# EAGLE design GRSS (EAGLE 7.7.0)

## Sheet 1 of 4: Title_TOC
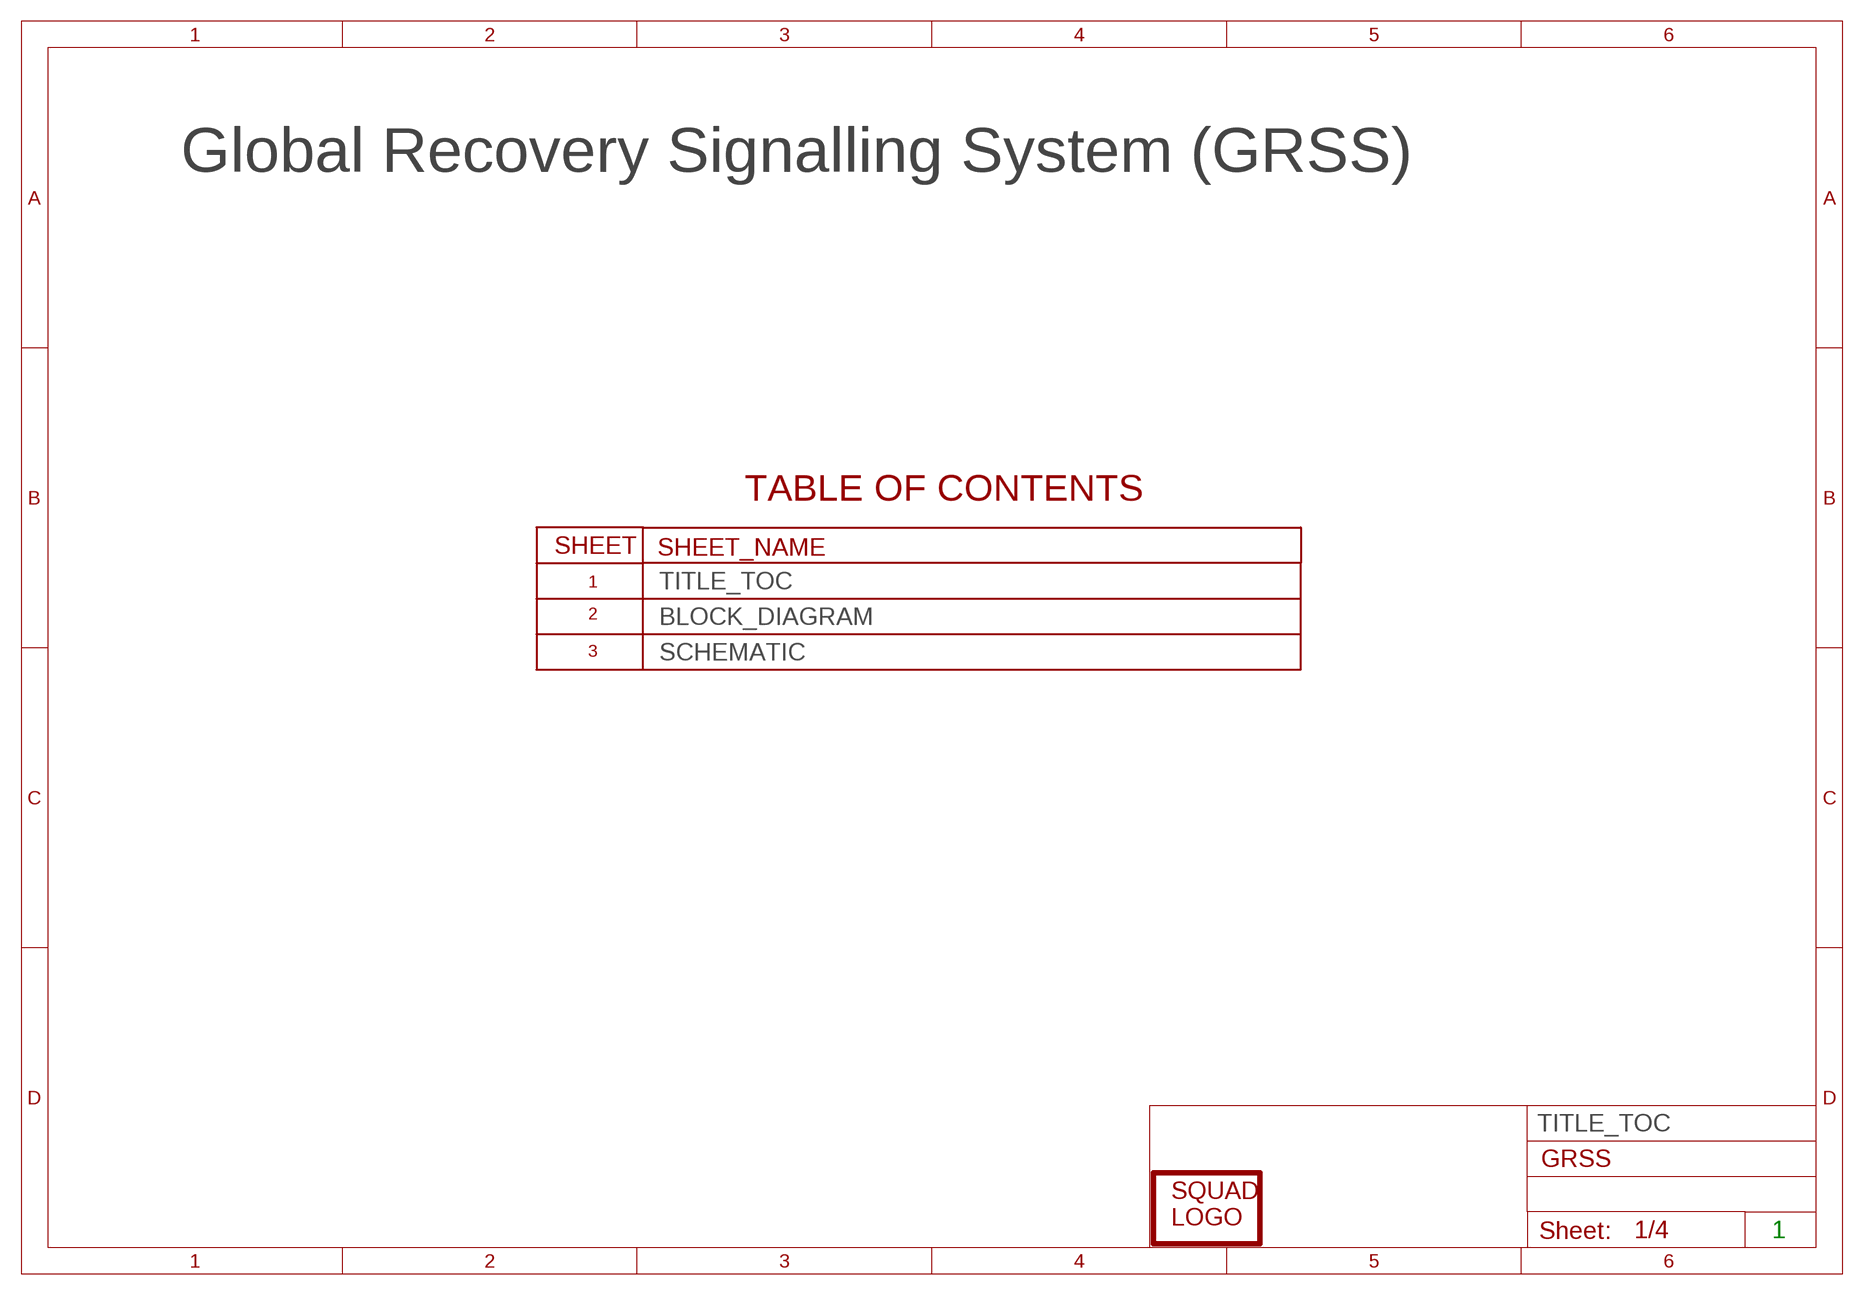
[diagram p0: schematic, sheet 1]
U$1 (TOC): VALUE: TOC

### Parts
LOGO1  LOGO  SQUAD_LOGO  [SQUAD_LOGO]

### Notes on the sheet
- Global Recovery Signalling System (GRSS)
- TITLE_TOC
- BLOCK_DIAGRAM
- SCHEMATIC
- TITLE_TOC
- 1

## Sheet 2 of 4: Block Diagram
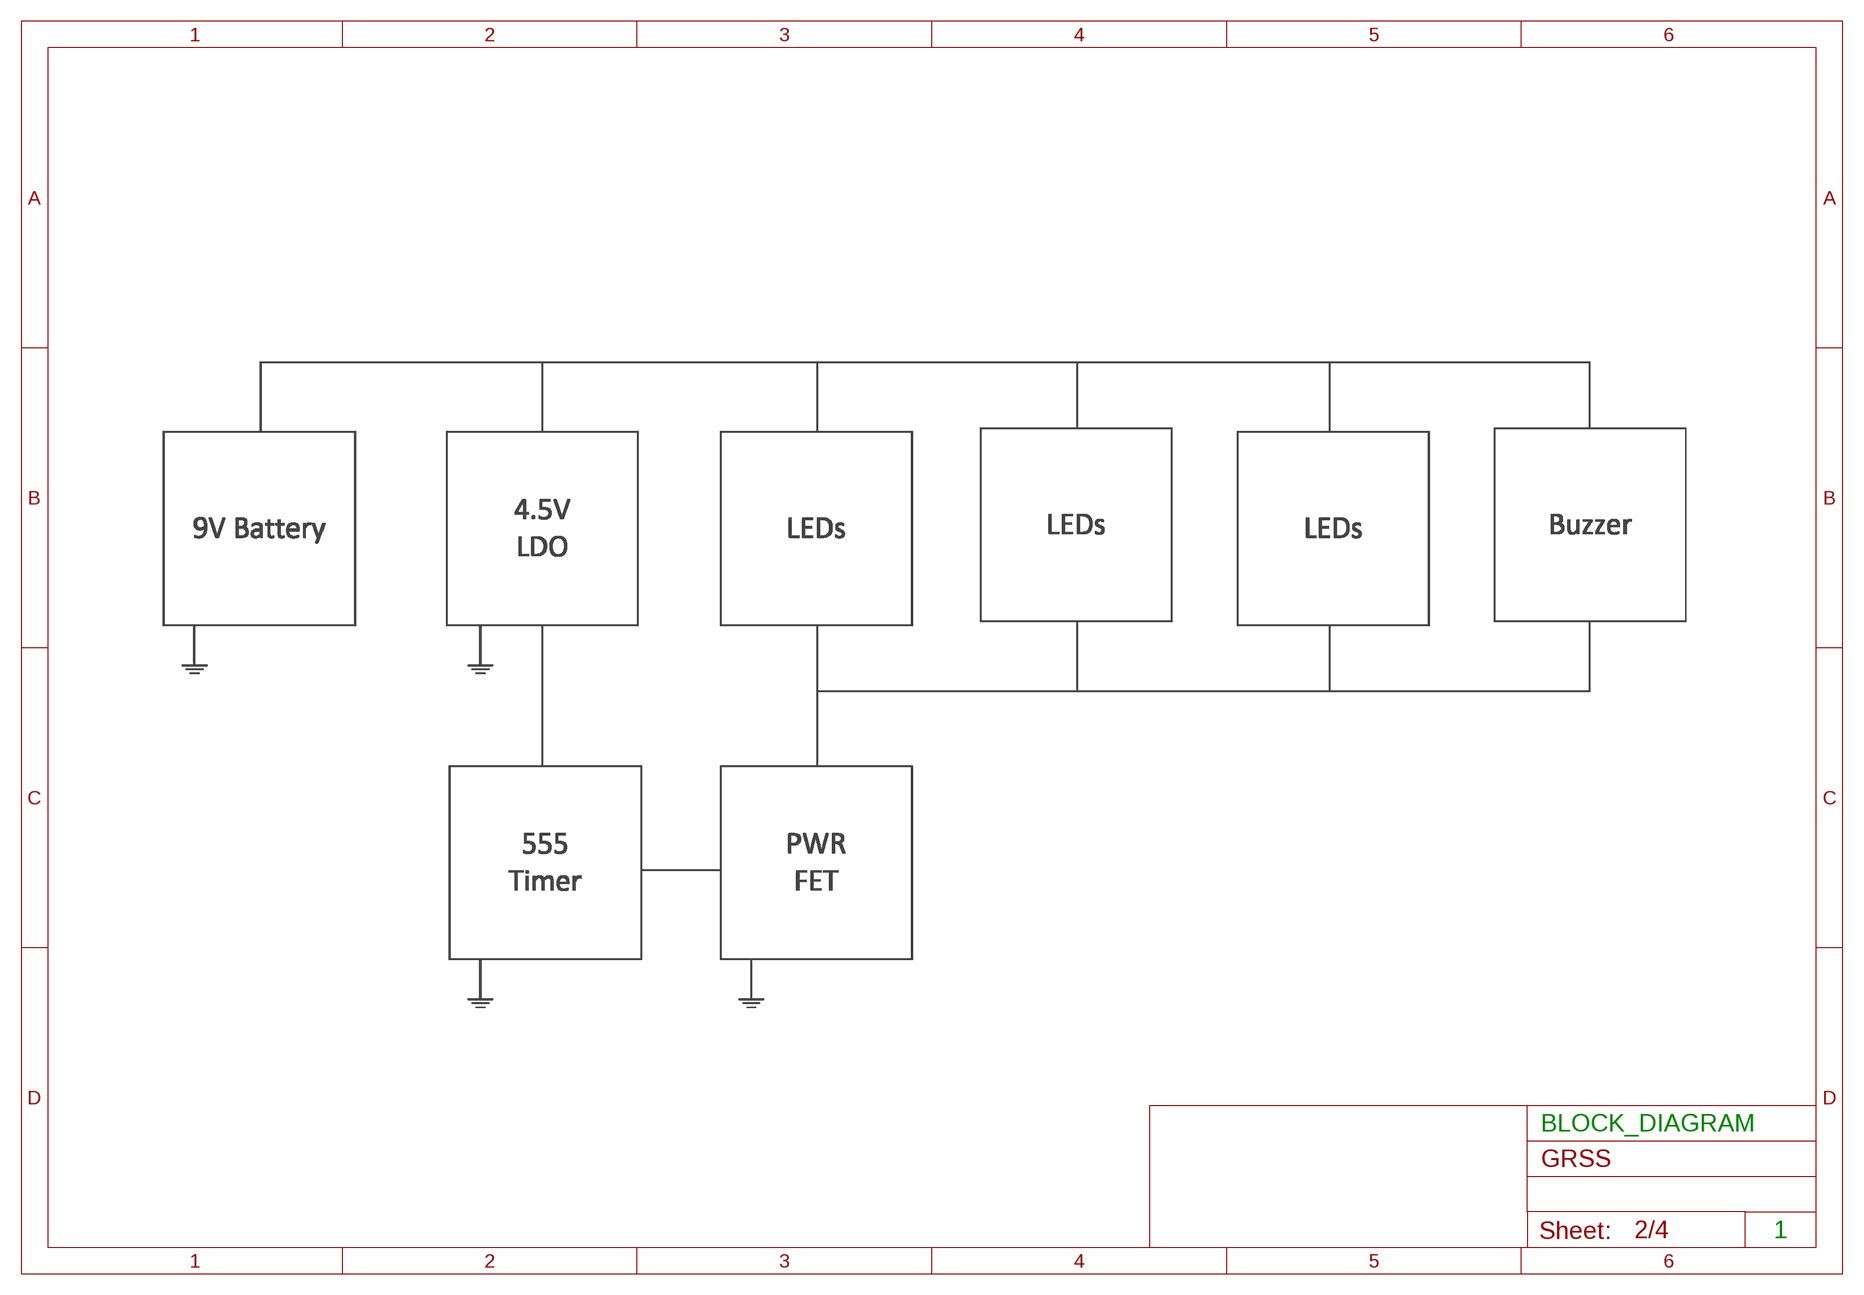
[diagram p1: schematic, sheet 2]

### Notes on the sheet
- BLOCK_DIAGRAM
- 1

## Sheet 3 of 4: Schematic
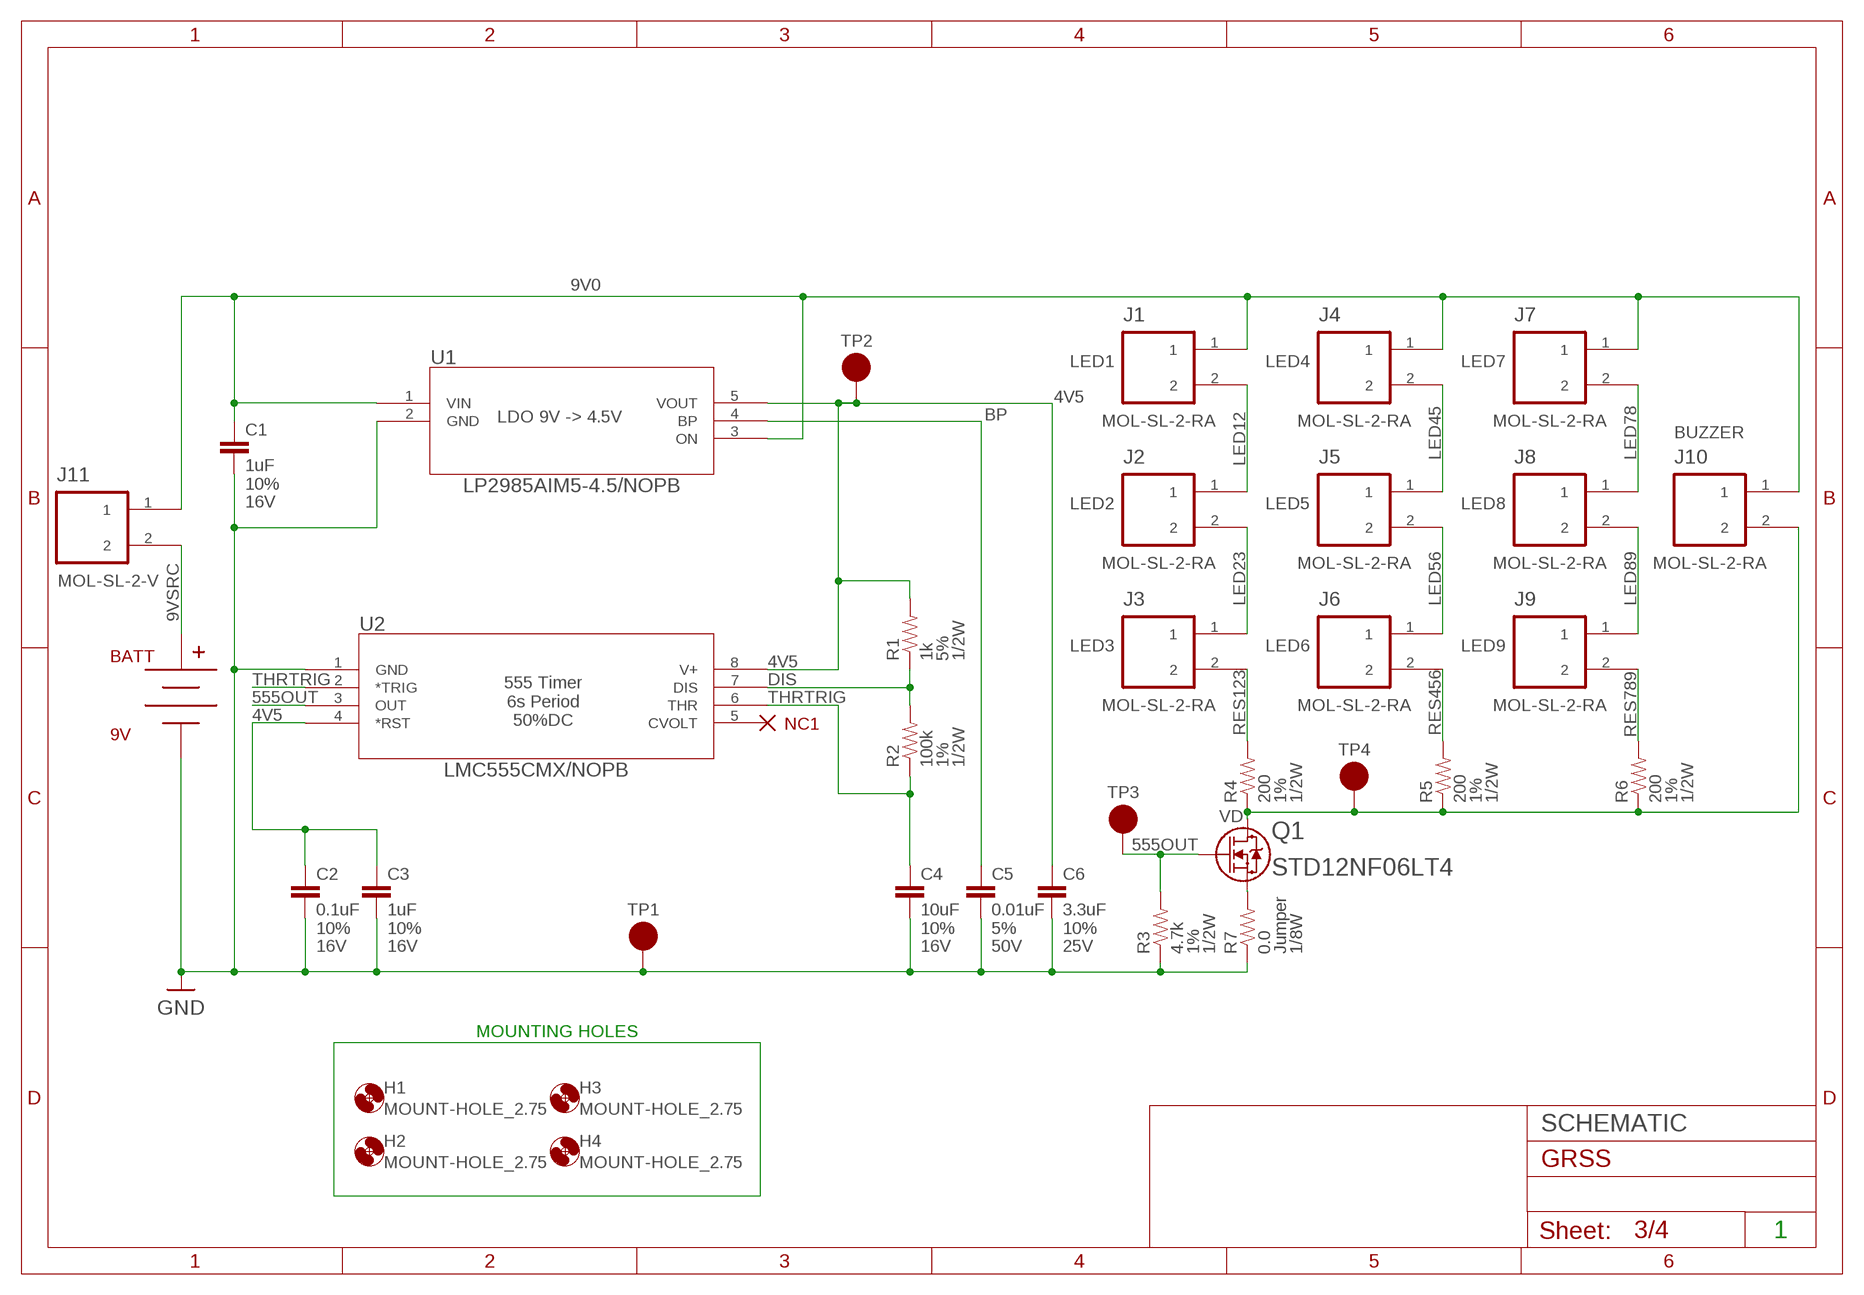
[diagram p2: schematic, sheet 3]

### Parts
BATT  9V  BH9VPC  [BC9VPC]
C1  1uF  CAP_1UF0_0805  [C0805]
C2  0.1uF  CAP_100NF0_0805  [C0805]
C3  1uF  CAP_1UF0_0805  [C0805]
C4  10uF  CAP_10UF0_0805  [C0805]
C5  0.01uF  CAP_10NF0_0805  [C0805]
C6  3.3uF  CAP_3UF3_0805  [C0805]
H1  MOUNT-HOLE_2.75  [2,75_HOLE_RASPI]
H2  MOUNT-HOLE_2.75  [2,75_HOLE_RASPI]
H3  MOUNT-HOLE_2.75  [2,75_HOLE_RASPI]
H4  MOUNT-HOLE_2.75  [2,75_HOLE_RASPI]
J1  MOL-SL-2-RA  MOLSL_2PIN_SL2RA_RA  [MOLSL-2-RA]
J2  MOL-SL-2-RA  MOLSL_2PIN_SL2RA_RA  [MOLSL-2-RA]
J3  MOL-SL-2-RA  MOLSL_2PIN_SL2RA_RA  [MOLSL-2-RA]
J4  MOL-SL-2-RA  MOLSL_2PIN_SL2RA_RA  [MOLSL-2-RA]
J5  MOL-SL-2-RA  MOLSL_2PIN_SL2RA_RA  [MOLSL-2-RA]
J6  MOL-SL-2-RA  MOLSL_2PIN_SL2RA_RA  [MOLSL-2-RA]
J7  MOL-SL-2-RA  MOLSL_2PIN_SL2RA_RA  [MOLSL-2-RA]
J8  MOL-SL-2-RA  MOLSL_2PIN_SL2RA_RA  [MOLSL-2-RA]
J9  MOL-SL-2-RA  MOLSL_2PIN_SL2RA_RA  [MOLSL-2-RA]
J10  MOL-SL-2-RA  MOLSL_2PIN_SL2RA_RA  [MOLSL-2-RA]
J11  MOL-SL-2-V  MOLSL_2PIN_SL2V_V  [MOLSL-2-V]
NC1  NC  NO_CONNECT  (no package)
Q1  STD12NF06LT4  [DPAK]
R1  1k  RES_1K0_0805  [R0805]
R2  100k  RES_100R0_0805  [R0805]
R3  4.7k  RES_47R0_0805  [R0805]
R4  200  RES_200R0_0805  [R0805]
R5  200  RES_200R0_0805  [R0805]
R6  200  RES_200R0_0805  [R0805]
R7  0.0  RES_0R0_0805  [R0805]
TP1  GND  TEST_POINT_TP10R_SMD_10R_SMD  [TP10R]
TP2  4V5  TEST_POINT_TP10R_SMD_10R_SMD  [TP10R]
TP3  555OUT  TEST_POINT_TP10R_SMD_10R_SMD  [TP10R]
TP4  VD  TEST_POINT_TP10R_SMD_10R_SMD  [TP10R]
U1  LP2985AIM5-4.5/NOPB  [MF05A]
U2  LMC555CMX/NOPB  [M08A]

### Nets
4V5: C2.1 C3.1 C6.1 R1.2 TP2.TP U1.5(VOUT) U2.4(*RST) U2.8(V+)
9V0: C1.1 J1.1 J4.1 J7.1 J10.1 J11.1 U1.1(VIN) U1.3(ON)
9VSRC: BATT.V+ J11.2
555OUT: Q1.1 R3.2 TP3.TP U2.3(OUT)
BP: C5.1 U1.4(BP)
DIS: R1.1 R2.2 U2.7(DIS)
GND: BATT.V- C1.2 C2.2 C3.2 C4.2 C5.2 C6.2 R3.1 R7.1 TP1.TP U1.2(GND) U2.1(GND)
LED12: J1.2 J2.1
LED23: J2.2 J3.1
LED45: J4.2 J5.1
LED56: J5.2 J6.1
LED78: J7.2 J8.1
LED89: J8.2 J9.1
NC: NC1.NC U2.5(CVOLT)
RES123: J3.2 R4.2
RES456: J6.2 R5.2
RES789: J9.2 R6.2
THRTRIG: C4.1 R2.1 U2.2(*TRIG) U2.6(THR)
VD: J10.2 Q1.3 R4.1 R5.1 R6.1 TP4.TP
ZEROOHM: Q1.2 R7.2

### Notes on the sheet
- LED1 | LED4 | LED7
- LDO 9V -> 4.5V
- BUZZER
- LED2 | LED5 | LED8
- LED3 | LED6 | LED9
- 555 Timer
  6s Period
  50%DC
- MOUNTING HOLES
- SCHEMATIC
- 1

## Sheet 4 of 4: Assembly Components
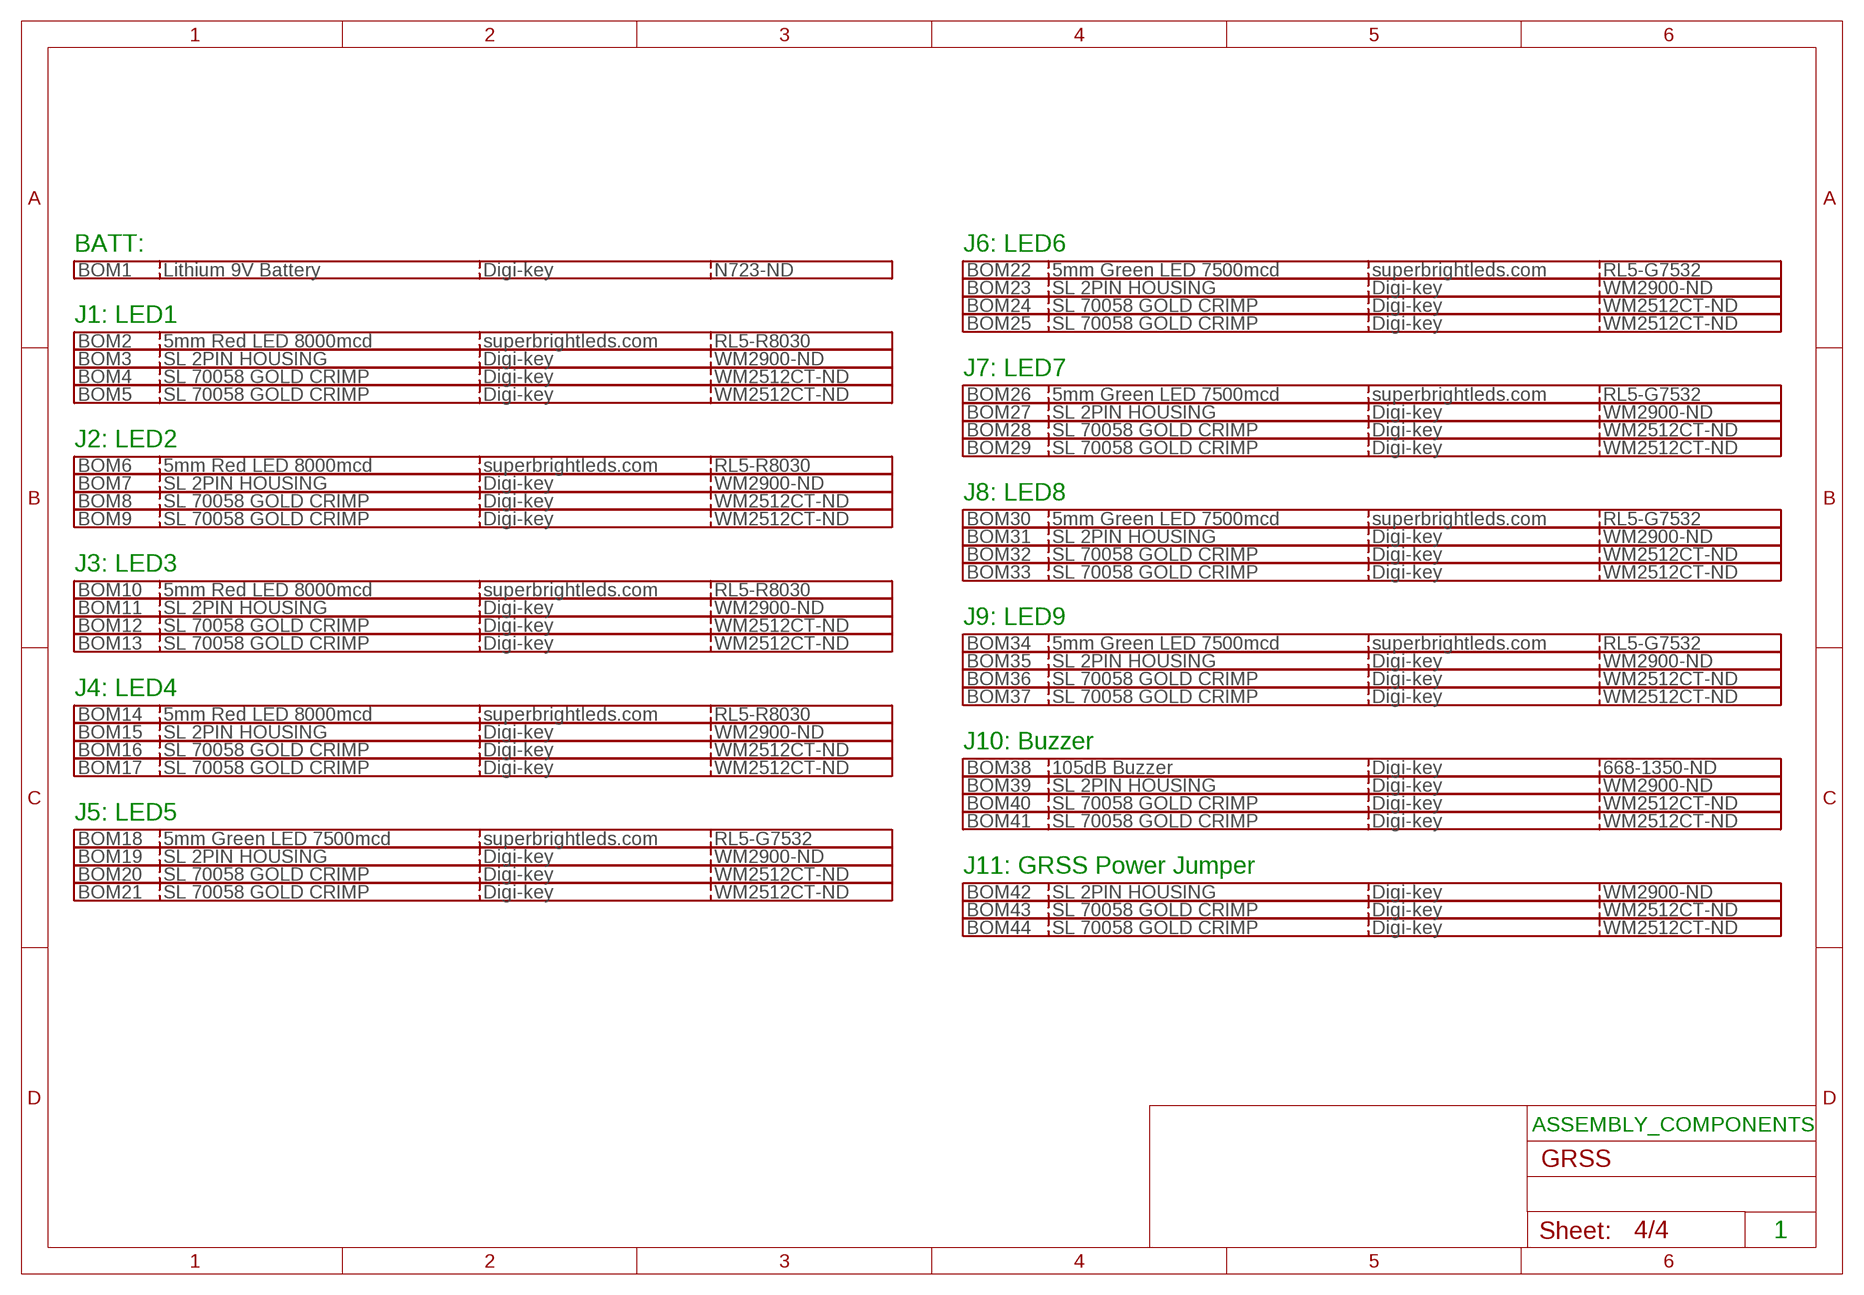
[diagram p3: schematic, sheet 4]

### Parts
BOM1  Lithium 9V Battery  BOM_LINE_ITEM_BLI0  [BLANK]
BOM2  5mm Red LED 8000mcd  BOM_LINE_ITEM_BLI1  [BLANK]
BOM3  SL 2PIN HOUSING  BOM_LINE_ITEM_BLI4  [BLANK]
BOM4  SL 70058 GOLD CRIMP  BOM_LINE_ITEM_BLI5  [BLANK]
BOM5  SL 70058 GOLD CRIMP  BOM_LINE_ITEM_BLI5  [BLANK]
BOM6  5mm Red LED 8000mcd  BOM_LINE_ITEM_BLI1  [BLANK]
BOM7  SL 2PIN HOUSING  BOM_LINE_ITEM_BLI4  [BLANK]
BOM8  SL 70058 GOLD CRIMP  BOM_LINE_ITEM_BLI5  [BLANK]
BOM9  SL 70058 GOLD CRIMP  BOM_LINE_ITEM_BLI5  [BLANK]
BOM10  5mm Red LED 8000mcd  BOM_LINE_ITEM_BLI1  [BLANK]
BOM11  SL 2PIN HOUSING  BOM_LINE_ITEM_BLI4  [BLANK]
BOM12  SL 70058 GOLD CRIMP  BOM_LINE_ITEM_BLI5  [BLANK]
BOM13  SL 70058 GOLD CRIMP  BOM_LINE_ITEM_BLI5  [BLANK]
BOM14  5mm Red LED 8000mcd  BOM_LINE_ITEM_BLI1  [BLANK]
BOM15  SL 2PIN HOUSING  BOM_LINE_ITEM_BLI4  [BLANK]
BOM16  SL 70058 GOLD CRIMP  BOM_LINE_ITEM_BLI5  [BLANK]
BOM17  SL 70058 GOLD CRIMP  BOM_LINE_ITEM_BLI5  [BLANK]
BOM18  5mm Green LED 7500mcd  BOM_LINE_ITEM_BLI2  [BLANK]
BOM19  SL 2PIN HOUSING  BOM_LINE_ITEM_BLI4  [BLANK]
BOM20  SL 70058 GOLD CRIMP  BOM_LINE_ITEM_BLI5  [BLANK]
BOM21  SL 70058 GOLD CRIMP  BOM_LINE_ITEM_BLI5  [BLANK]
BOM22  5mm Green LED 7500mcd  BOM_LINE_ITEM_BLI2  [BLANK]
BOM23  SL 2PIN HOUSING  BOM_LINE_ITEM_BLI4  [BLANK]
BOM24  SL 70058 GOLD CRIMP  BOM_LINE_ITEM_BLI5  [BLANK]
BOM25  SL 70058 GOLD CRIMP  BOM_LINE_ITEM_BLI5  [BLANK]
BOM26  5mm Green LED 7500mcd  BOM_LINE_ITEM_BLI2  [BLANK]
BOM27  SL 2PIN HOUSING  BOM_LINE_ITEM_BLI4  [BLANK]
BOM28  SL 70058 GOLD CRIMP  BOM_LINE_ITEM_BLI5  [BLANK]
BOM29  SL 70058 GOLD CRIMP  BOM_LINE_ITEM_BLI5  [BLANK]
BOM30  5mm Green LED 7500mcd  BOM_LINE_ITEM_BLI2  [BLANK]
BOM31  SL 2PIN HOUSING  BOM_LINE_ITEM_BLI4  [BLANK]
BOM32  SL 70058 GOLD CRIMP  BOM_LINE_ITEM_BLI5  [BLANK]
BOM33  SL 70058 GOLD CRIMP  BOM_LINE_ITEM_BLI5  [BLANK]
BOM34  5mm Green LED 7500mcd  BOM_LINE_ITEM_BLI2  [BLANK]
BOM35  SL 2PIN HOUSING  BOM_LINE_ITEM_BLI4  [BLANK]
BOM36  SL 70058 GOLD CRIMP  BOM_LINE_ITEM_BLI5  [BLANK]
BOM37  SL 70058 GOLD CRIMP  BOM_LINE_ITEM_BLI5  [BLANK]
BOM38  105dB Buzzer  BOM_LINE_ITEM_BLI3  [BLANK]
BOM39  SL 2PIN HOUSING  BOM_LINE_ITEM_BLI4  [BLANK]
BOM40  SL 70058 GOLD CRIMP  BOM_LINE_ITEM_BLI5  [BLANK]
BOM41  SL 70058 GOLD CRIMP  BOM_LINE_ITEM_BLI5  [BLANK]
BOM42  SL 2PIN HOUSING  BOM_LINE_ITEM_BLI4  [BLANK]
BOM43  SL 70058 GOLD CRIMP  BOM_LINE_ITEM_BLI5  [BLANK]
BOM44  SL 70058 GOLD CRIMP  BOM_LINE_ITEM_BLI5  [BLANK]

### Notes on the sheet
- BATT: | J6: LED6
- J1: LED1
- J7: LED7
- J2: LED2
- J8: LED8
- J3: LED3
- J9: LED9
- J4: LED4
- J10: Buzzer
- J5: LED5
- J11: GRSS Power Jumper
- ASSEMBLY_COMPONENTS
- 1

## Library data of the parts
BATT = grss:BH9VPC: 9V board-mount battery cradle; MANUFACTURER: MPD; MANUFACTURER_PN: BH9VPC; PROD_ID: BATT-10855; VENDOR: Digi-key; VENDOR_PN: BH9V-PC-ND
BOM1 = grss:BOM_LINE_ITEM; MANUFACTURER: Energizer; MANUFACTURER_PN: L522; VENDOR: Digi-key; VENDOR_PN: N723-ND
BOM2 BOM6 BOM10 BOM14 = grss:BOM_LINE_ITEM; VENDOR: superbrightleds.com; VENDOR_PN: RL5-R8030
BOM3 BOM7 BOM11 BOM15 BOM19 BOM23 BOM27 BOM31 BOM35 BOM39 BOM42 = grss:BOM_LINE_ITEM; MANUFACTURER: Molex; MANUFACTURER_PN: 50579402; VENDOR: Digi-key; VENDOR_PN: WM2900-ND
BOM4 BOM5 BOM8 BOM9 BOM12 BOM13 BOM16 BOM17 BOM20 BOM21 BOM24 BOM25 BOM28 BOM29 BOM32 BOM33 BOM36 BOM37 BOM40 BOM41 BOM43 BOM44 = grss:BOM_LINE_ITEM; MANUFACTURER: Molex; MANUFACTURER_PN: 0016020087; VENDOR: Digi-key; VENDOR_PN: WM2512CT-ND
BOM18 BOM22 BOM26 BOM30 BOM34 = grss:BOM_LINE_ITEM; VENDOR: superbrightleds.com; VENDOR_PN: RL5-G7532
BOM38 = grss:BOM_LINE_ITEM; MANUFACTURER: PUI Audio; MANUFACTURER_PN: AI-3135-TF-LW100-R; VENDOR: Digi-key; VENDOR_PN: 668-1350-ND
C1 C3 = grss:CAP: Chip Capacitor; MANUFACTURER: Murata; MANUFACTURER_PN: GRM21BR71C105KA01L; TEMP_COEFF: X7R; TOLERANCE: 10%; VENDOR: Digi-key; VENDOR_PN: 490-1691-1-ND; VOLTAGE: 16V
C2 = grss:CAP: Chip Capacitor; MANUFACTURER: Murata; MANUFACTURER_PN: GRM219R71C104KA01D; TEMP_COEFF: X7R; TOLERANCE: 10%; VENDOR: Digi-key; VENDOR_PN: 490-1683-1-ND; VOLTAGE: 16V
C4 = grss:CAP: Chip Capacitor; MANUFACTURER: Murata; MANUFACTURER_PN: GRM21BC81C106KA73L; TEMP_COEFF: X6S; TOLERANCE: 10%; VENDOR: Digi-key; VENDOR_PN: 490-5519-1-ND; VOLTAGE: 16V
C5 = grss:CAP: Chip Capacitor; MANUFACTURER: Murata; MANUFACTURER_PN: GRM216R71H103JA01D; TEMP_COEFF: X7R; TOLERANCE: 5%; VENDOR: Digi-key; VENDOR_PN: 490-9742-1-ND; VOLTAGE: 50V
C6 = grss:CAP: Chip Capacitor; MANUFACTURER: Murata; MANUFACTURER_PN: GRM21BR71E335KA73L; TEMP_COEFF: X7R; TOLERANCE: 10%; VENDOR: Digi-key; VENDOR_PN: 490-6486-1-ND; VOLTAGE: 25V
H1-H4 = grss:MOUNT-HOLE: MOUNTING HOLE with drill center marker
J1-J10 = grss:MOLSL_2PIN: Molex SL Series 2-Position Connector Wire to board 2.54 mm (.1 inch) pitch header (right-angle or vertical) Housing: Vendor=Molex, Vendor_PN=0050579402 22-24 AWG Crimp: Vendor=Molex, Vendor_PN=0016020087 Wires: AWG,Amps (Max) 22, 3.0 24, 3.0 26, 1.8 28, 1.2; FINISH: GOLD; LOCKING: YES; MANUFACTURER: Molex; MANUFACTURER_PN: 0705530001; MAX_CURRENT: 3.0A; MOUNT_ANGLE: RIGHT; MOUNT_TYPE: TH; POSITIONS: 2; VENDOR: Digi-key; VENDOR_PN: WM4900-ND
J11 = grss:MOLSL_2PIN: Molex SL Series 2-Position Connector Wire to board 2.54 mm (.1 inch) pitch header (right-angle or vertical) Housing: Vendor=Molex, Vendor_PN=0050579402 22-24 AWG Crimp: Vendor=Molex, Vendor_PN=0016020087 Wires: AWG,Amps (Max) 22, 3.0 24, 3.0 26, 1.8 28, 1.2; FINISH: GOLD; LOCKING: YES; MANUFACTURER: Molex; MANUFACTURER_PN: 0705430001; MAX_CURRENT: 3.0A; MOUNT_ANGLE: VERTICAL; MOUNT_TYPE: TH; POSITIONS: 2; VENDOR: Digi-key; VENDOR_PN: WM4800-ND
LOGO1 = grss:SQUAD_LOGO
NC1 = grss:NO_CONNECT: No Connect
Q1 = grss:STD12NF06LT4: 12V Power FET; MANUFACTURER: STMicroelectronics; MANUFACTURER_PN: STD12NF06LT4; VENDOR: Digi-key; VENDOR_PN: 497-2487-1-ND
R1 = grss:RES: Chip Resistor; MANUFACTURER: Panasonic; MANUFACTURER_PN: ERJ-P06J102V; POWER: 1/2W; TOLERANCE: 5%; VENDOR: Digi-key; VENDOR_PN: P1.0KADCT-ND
R2 = grss:RES: Chip Resistor; MANUFACTURER: Panasonic; MANUFACTURER_PN: ERJ-P06F1003V; POWER: 1/2W; TOLERANCE: 1%; VENDOR: Digi-key; VENDOR_PN: P16060CT-ND
R3 = grss:RES: Chip Resistor; MANUFACTURER: Panasonic; MANUFACTURER_PN: ERJ-P06F4701V; POWER: 1/2W; TOLERANCE: 1%; VENDOR: Digi-key; VENDOR_PN: P16073CT-ND
R4-R6 = grss:RES: Chip Resistor; MANUFACTURER: Panasonic; MANUFACTURER_PN: ERJ-P06F2000V; POWER: 1/2W; TOLERANCE: 1%; VENDOR: Digi-key; VENDOR_PN: P16064CT-ND
R7 = grss:RES: Chip Resistor; MANUFACTURER: Panasonic; MANUFACTURER_PN: ERJ-6GEY0R00V; POWER: 1/8W; TOLERANCE: Jumper; VENDOR: Digi-key; VENDOR_PN: P0.0ACT-ND
TP1-TP4 = grss:TEST_POINT: Test Point (various sizes)
U1 = grss:LP2985AIM5-4.5/NOPB: 4.5V LDO; MANUFACTURER: Texas Instruments; MANUFACTURER_PN: LP2985AIM5-4.5/NOPB; VENDOR: Digi-key; VENDOR_PN: LP2985AIM5-4.5/NOPBCT-ND
U2 = grss:LMC555CMX/NOPB: 555 Timer; MANUFACTURER: Texas Instruments; MANUFACTURER_PN: LMC555CMX/NOPB; VENDOR: Digi-key; VENDOR_PN: LMC555CMX/NOPBCT-ND

## Board
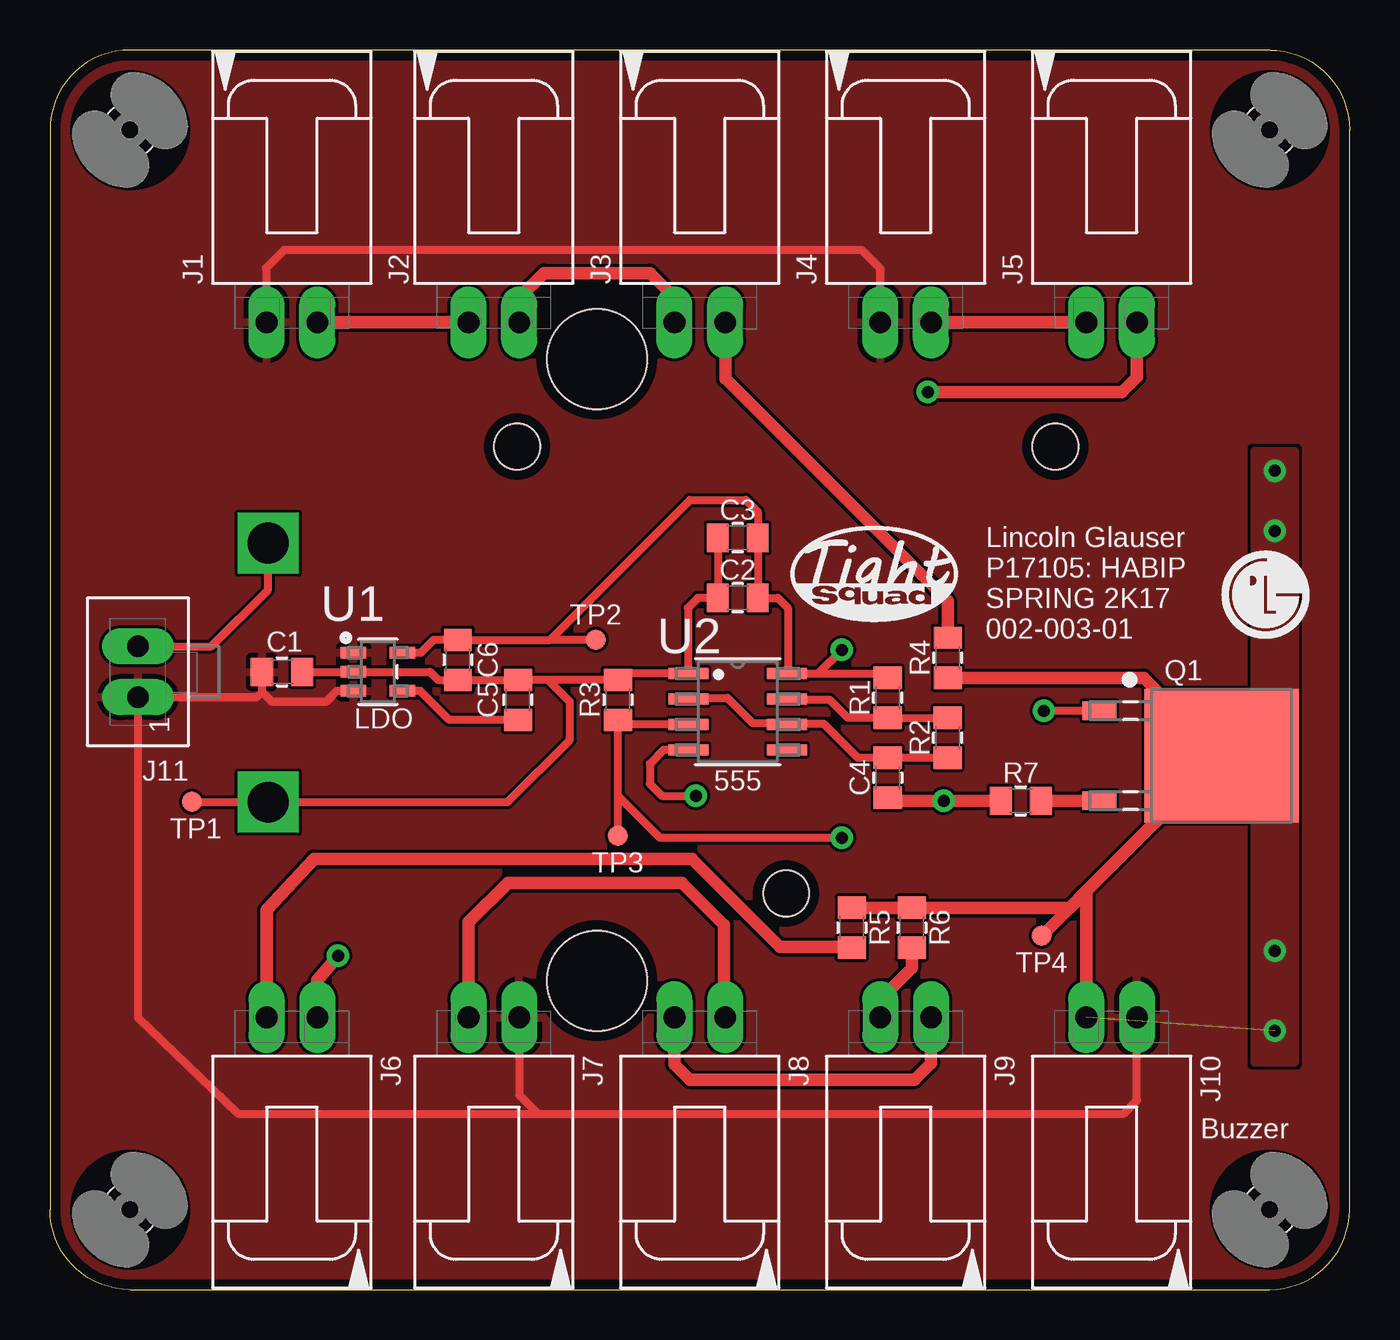
[diagram p4: board, top side]
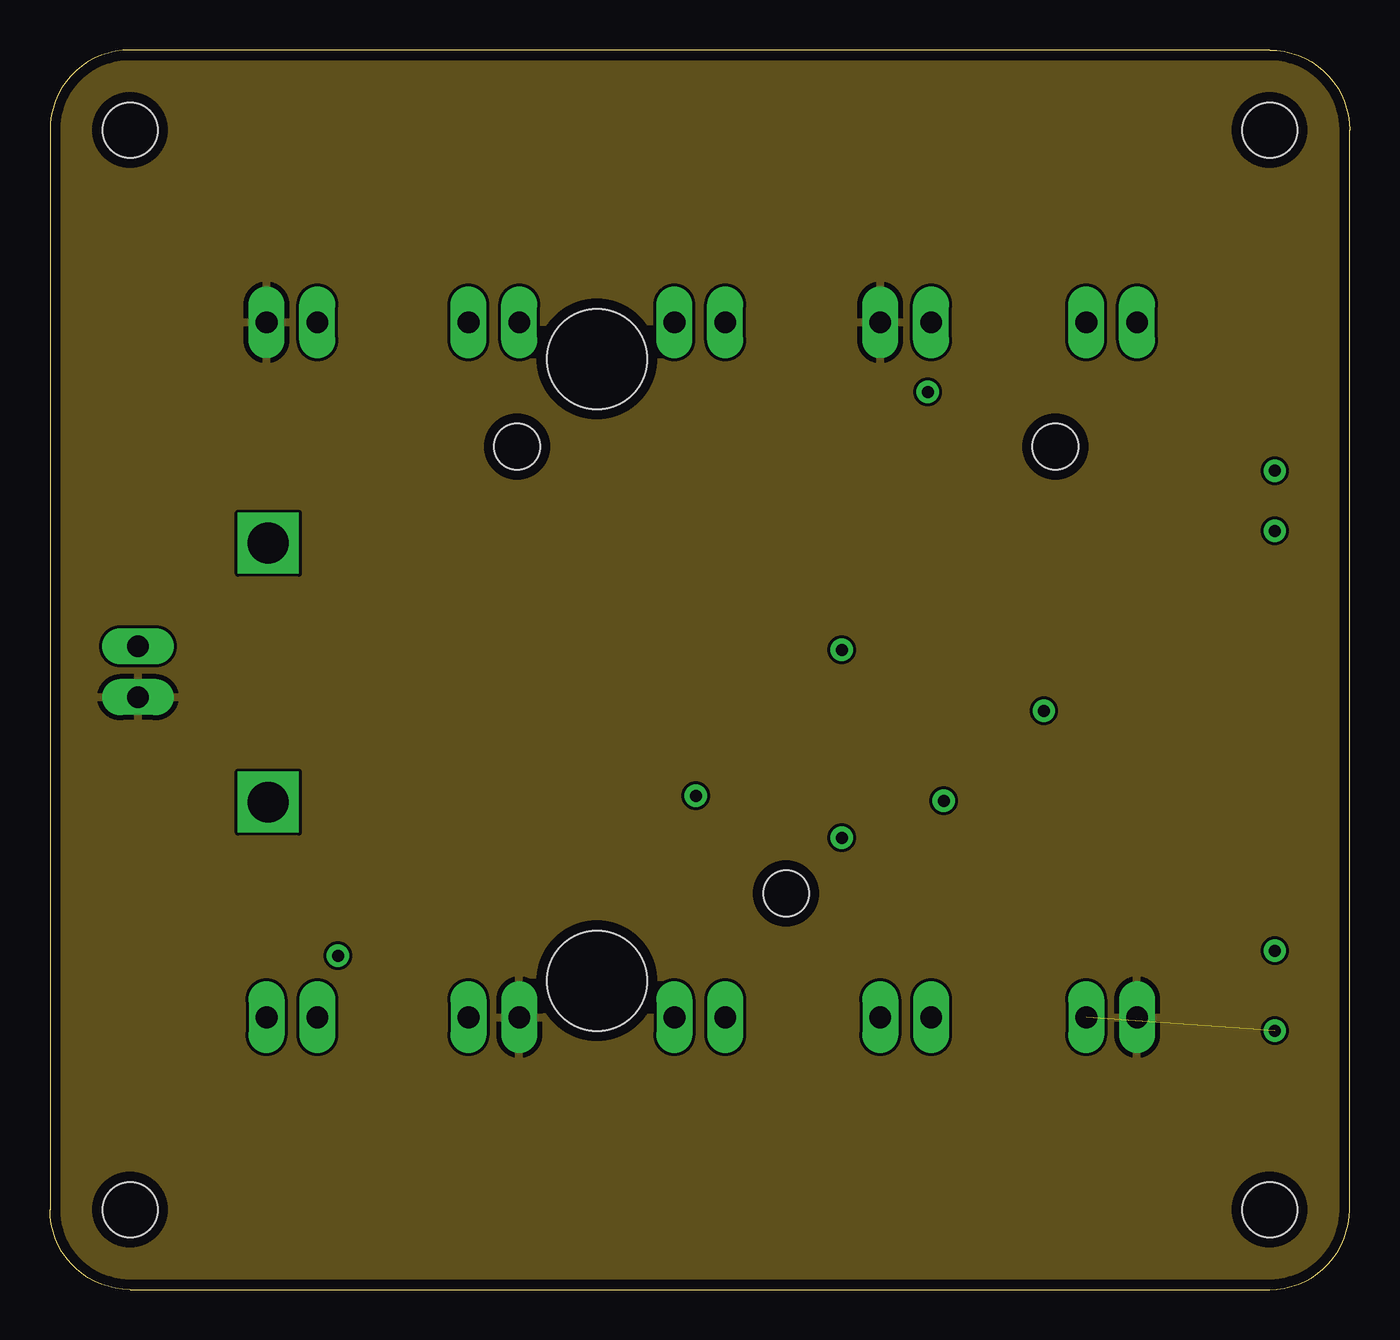
[diagram p5: board, inner layer PWR]
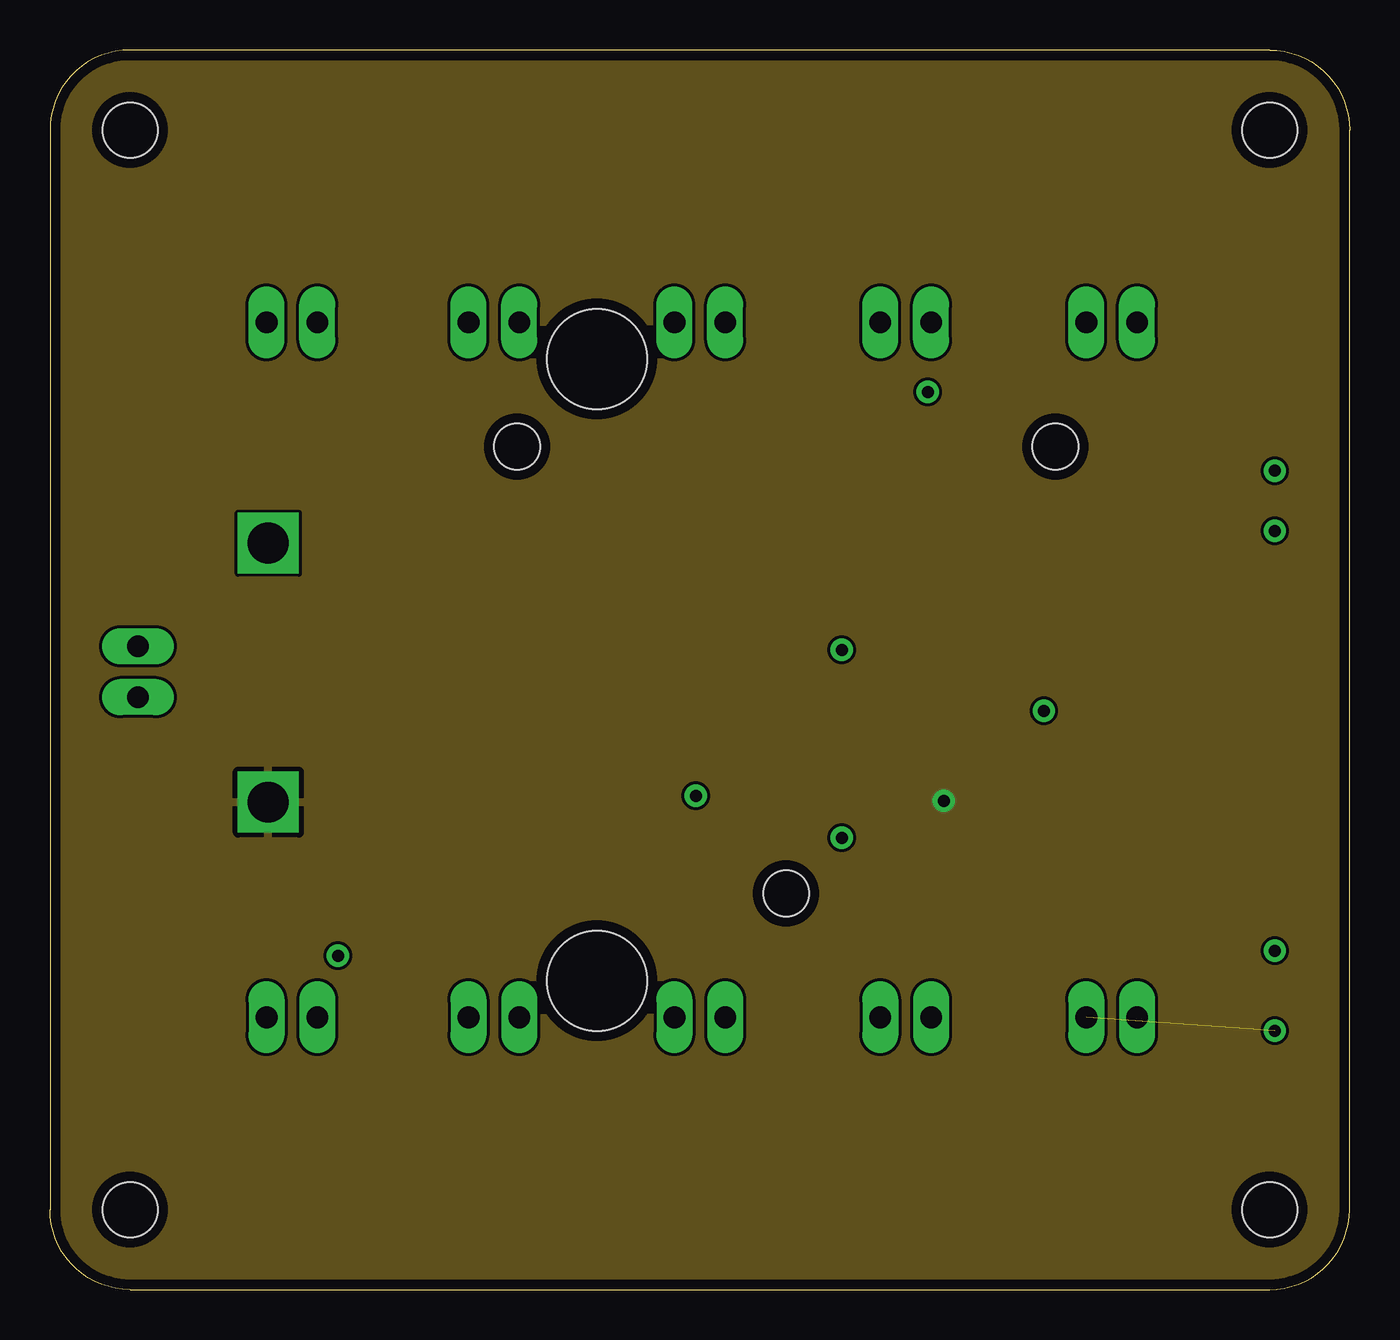
[diagram p6: board, inner layer GND]
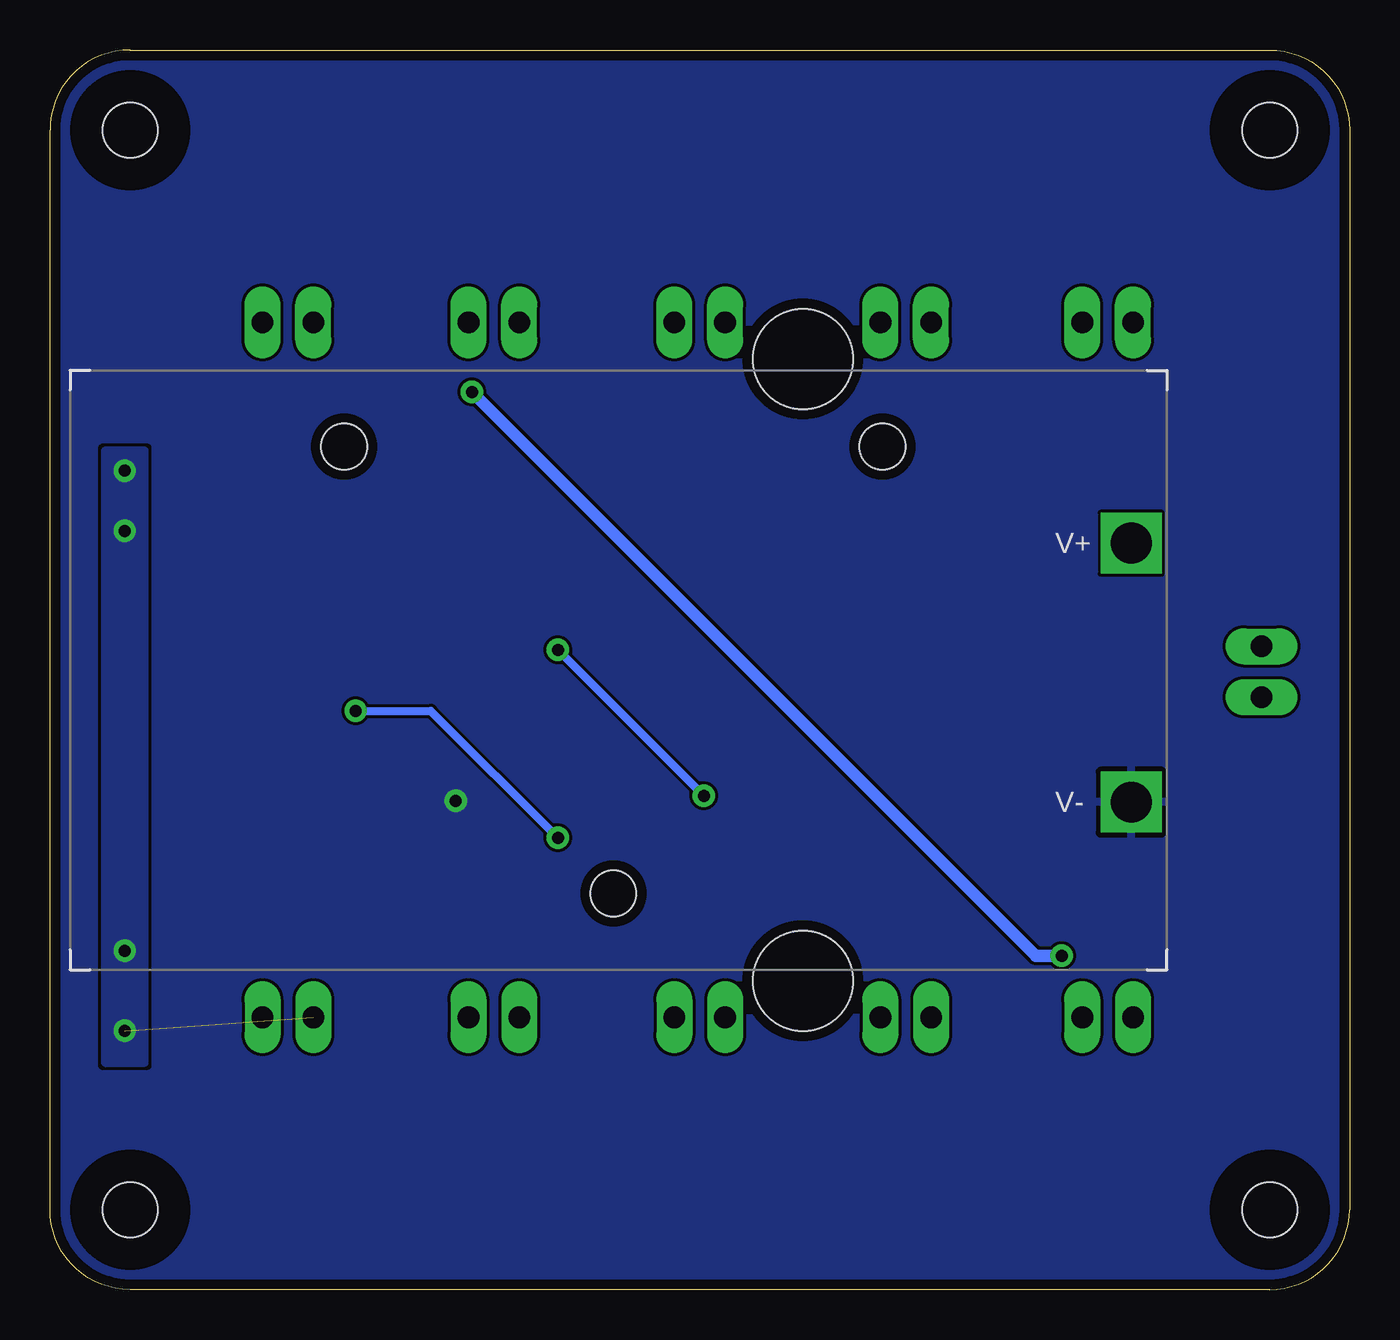
[diagram p7: board, bottom side, seen from below]

Size 65 x 62 mm. Coordinates in mm from the lower left corner, seen from the top.
Outline: 4,0 61,0 arc90 65,4 65,58 arc90 61,62 4,62 arc90 0,58 0,4 arc90 4,0
Copper layers (1+2*15+16): Top 0.035mm / dielectric 0.486mm / PWR 0.035mm / dielectric 0.488mm / GND 0.035mm / dielectric 0.486mm / Bottom 0.035mm
Design rules "4layer_4pcb": minimum track width 6mil, minimum drill 15mil, track to track 6mil, track to pad 6mil, pad to pad 6mil, via to via 6mil, smd to smd 6mil, copper to edge 20mil, drill to drill 10mil, minimum pad ring 14mil, minimum via ring 10mil, stop-mask expansion 2.5mil, vias tented up to drill 16mil, thermal gap 10mil
Holes 5 mm at 27.35,46.55 27.35,15.45

### Footprints (pad centres in the part's own frame; a part is rotated, then mirrored left to right if it is on the bottom)
BC9VPC = drill 2.032 square: V+ 53.086,21.336; V- 53.086,8.382 | hole 2.286: 27.178,3.81; 13.716,26.162; 40.64,26.162
C0805 = smd 1.1 x 1.4: 1 -1,0; 2 1,0
2,75_HOLE_RASPI = hole 2.75: 0,0
MOLSL-2-RA = drill 1.09 long: 1 -1.27,-7.62; 2 1.27,-7.62
MOLSL-2-V = drill 1.09 long: 1 -1.27,0; 2 1.27,0
DPAK = smd 0.94 x 1.702: 1 -2.25,-6.109; 2 2.25,-6.109 | smd 6.655 x 7.722: 3 0,0
R0805 = smd 1.1 x 1.4: 1 -1,0; 2 1,0
TP10R = smd 1 x 1: TP 0,0
MF05A = smd 1.27 x 0.559: 1 -1.219,0.953; 2 -1.219,0; 3 -1.219,-0.953; 4 1.219,-0.953; 5 1.219,0.953
M08A = smd 1.981 x 0.559: 1 -2.464,1.905; 2 -2.464,0.635; 3 -2.464,-0.635; 4 -2.464,-1.905; 5 2.464,-1.905; 6 2.464,-0.635; 7 2.464,0.635; 8 2.464,1.905

### Placement (x,y rotation side)
BATT  64,16 0 bottom
BOM1  -4,-0.9 0 top  (outside the outline)
BOM2  -4.5,-2.6 0 top  (outside the outline)
BOM3  -5,-4.3 0 top  (outside the outline)
BOM4  -5.5,-6 0 top  (outside the outline)
BOM5  -6,-7.7 0 top  (outside the outline)
BOM6  -6,-9.8 0 top  (outside the outline)
BOM7  -6,-11.9 0 top  (outside the outline)
BOM8  -6,-14 0 top  (outside the outline)
BOM9  -6,-16.1 0 top  (outside the outline)
BOM10  -6,-18.2 0 top  (outside the outline)
BOM11  -6,-20.3 0 top  (outside the outline)
BOM12  -6,-22.4 0 top  (outside the outline)
BOM13  -6,-24.5 0 top  (outside the outline)
BOM14  -6,-26.6 0 top  (outside the outline)
BOM15  -6,-28.7 0 top  (outside the outline)
BOM16  -6,-30.8 0 top  (outside the outline)
BOM17  -6,-32.9 0 top  (outside the outline)
BOM18  -6.5,-34.6 0 top  (outside the outline)
BOM19  -6.5,-36.7 0 top  (outside the outline)
BOM20  -6.5,-38.8 0 top  (outside the outline)
BOM21  -6.5,-40.9 0 top  (outside the outline)
BOM22  -6.5,-43 0 top  (outside the outline)
BOM23  -6.5,-45.1 0 top  (outside the outline)
BOM24  -6.5,-47.2 0 top  (outside the outline)
BOM25  -6.5,-49.3 0 top  (outside the outline)
BOM26  -6.5,-51.4 0 top  (outside the outline)
BOM27  -6.5,-53.5 0 top  (outside the outline)
BOM28  -6.5,-55.6 0 top  (outside the outline)
BOM29  -6.5,-57.7 0 top  (outside the outline)
BOM30  -6.5,-59.8 0 top  (outside the outline)
BOM31  -6.5,-61.9 0 top  (outside the outline)
BOM32  -6.5,-64 0 top  (outside the outline)
BOM33  -6.5,-66.1 0 top  (outside the outline)
BOM34  -6.5,-68.2 0 top  (outside the outline)
BOM35  -6.5,-70.3 0 top  (outside the outline)
BOM36  -6.5,-72.4 0 top  (outside the outline)
BOM37  -6.5,-74.5 0 top  (outside the outline)
BOM38  -7,-90.9 0 top  (outside the outline)
BOM39  -6.5,-78.7 0 top  (outside the outline)
BOM40  -6.5,-80.8 0 top  (outside the outline)
BOM41  -6.5,-82.9 0 top  (outside the outline)
BOM42  -6.5,-85 0 top  (outside the outline)
BOM43  -6.5,-87.1 0 top  (outside the outline)
BOM44  -6.5,-89.2 0 top  (outside the outline)
C1  11.6,30.9 0 top
C2  34.4,34.6 180 top
C3  34.4,37.6 180 top
C4  41.9,25.6 270 top
C5  23.4,29.5 90 top
C6  20.4,31.5 270 top
E$1  [LG]  58.6,32.55 0 top
H1  4,4 0 top
H2  61,4 0 top
H3  4,58 0 top
H4  61,58 0 top
J1  12.1,56 0 top
J2  22.2,56 0 top
J3  32.5,56 0 top
J4  42.8,56 0 top
J5  53.1,56 0 top
J6  12.1,6 180 top
J7  22.2,6 180 top
J8  32.5,6 180 top
J9  42.8,6 180 top
J10  53.1,6 180 top
J11  4.4,30.9 90 top
LOGO1  37,33.35 0 top
Q1  58.6,26.7 270 top
R1  41.9,29.6 90 top
R2  44.9,27.6 90 top
R3  28.4,29.5 270 top
R4  44.91,31.6 90 top
R5  40.1,18.1 270 top
R6  43.1,18.1 270 top
R7  48.56,24.45 0 top
TP1  7.1,24.4 0 top
TP2  27.3,32.5 0 top
TP3  28.4,22.7 0 top
TP4  49.6,17.7 0 top
U1  16.4,30.9 0 top
U2  34.4,28.9 0 top

### Tracks (layer width: path | path; a pad name or v marks a point on that pad's centre or on a via)
4V5  (via drill 0.6)
  Top 0.406: 42.04,30.89 R1.2 41.9,30.8 U2.8 | U1.5 18.54,31.85 19.19,32.5 C6.1 25,32.5 | U2.4 30.7,27 30,26.3 30,25.3 30.6,24.7 v32.3,24.7 | U2.8 38.41,30.8 v39.6,32 | U2.8 36.9,30.84 36.9,34.1 36.4,34.6 C2.1 C3.1 35.4,38.9 34.8,39.5 32,39.5 25,32.5 | TP2.TP 25,32.5
  Bottom 0.406: v32.3,24.7 v39.6,32
9V0
  Top 0.406: 10.6,29.9 C1.1 | U1.3 14.35,29.95 13.8,29.4 11.1,29.4 10.6,29.9 | J7.1 23.47,9.73 24.4,8.8 | 24.4,8.8 9.4,8.8 4.4,13.6 J11.1 10.33,29.63 10.6,29.9 | 24.4,8.8 53.7,8.8 54.37,9.47 J10.1 | J4.1 41.53,51.07 40.6,52 11.7,52 10.8,51.1 10.8,48.41 J1.1
  pour Top (rank 6): 0,62 0,0 65,0 65,62
  pour Top (rank 6): 0,62 0,0 65,0 65,62
  pour PWR (rank 6): 0,62 0,0 65,0 65,62
9VSRC
  Top 0.406: J11.2 8.07,32.17 10.9,35 10.9,37.32 BATT.V+
555OUT  (via drill 0.6)
  Top 0.406: U2.3 28.64,28.27 R3.2 28.4,24.7 | Q1.1 v49.71,28.95 | v39.6,22.6 30.5,22.6 28.4,24.7 | TP3.TP 28.4,24.7
  Bottom 0.406: v49.71,28.95 45.95,28.95 v39.6,22.6
BP
  Top 0.406: C5.1 19.97,28.5 18.52,29.95 U1.4
DIS
  Top 0.406: U2.7 36.9,29.5 39,29.5 39.9,28.6 R1.1 R2.2
GND  (via drill 0.6)
  Top 0.406: C3.2 C2.2 32.4,34.6 31.9,34.1 31.9,30.84 U2.1 28.7,30.8 R3.1 C5.2 | C1.2 U1.2 19,30.9 19.4,30.5 C6.2 C5.2 | 42.05,24.45 C4.2 | C5.2 24.9,30.5 26,29.4 26,27.5 22.88,24.38 BATT.V- 10.9,24.4 TP1.TP
  Top 0.635: R7.1 v44.7,24.45 42.05,24.45
  pour Bottom (rank 6): 0,62 0,0 65,0 65,62
  pour GND (rank 6): 0,62 0,0 65,0 65,62
LED12
  Top 0.635: J1.2 J2.1
LED23
  Top 0.635: J2.2 23.47,49.62 24.7,50.85 30,50.85 31.2,49.65 31.2,48.41 J3.1
LED45
  Top 0.635: J4.2 J5.1
LED56  (via drill 0.6)
  Top 0.406: 54.4,48.35 J5.2
  Top 0.635: v43.9,44.9 53.62,44.9 54.37,45.65 J5.2 | J6.1 13.37,15.47 v14.4,16.7
  Bottom 0.635: v14.4,16.7 15.7,16.7 v43.9,44.9
LED78
  Top 0.635: J7.2 20.93,18.38 22.9,20.35 31.6,20.35 33.7,18.25 33.7,13.69 J8.1
LED89
  Top 0.406: J9.1
  Top 0.635: J8.2 31.23,11.27 32,10.5 43.24,10.5 44.06,11.32 J9.1
RES123
  Top 0.406: J3.2
  Top 0.635: R4.2 44.91,34.43 33.78,45.56 J3.2
RES456
  Top 0.635: J6.2 10.83,18.98 13.2,21.55 32.1,21.55 36.5,17.15 40.05,17.15 R5.2
RES789
  Top 0.635: R6.2 43.1,16.08 41.53,14.51 J9.2
THRTRIG
  Top 0.406: 36.92,28.32 U2.6 | U2.2 32.05,29.6 33.88,29.6 35.13,28.35 36.95,28.35 U2.6 | R2.1 C4.1 40.4,26.6 38.7,28.3 36.9,28.3 U2.6
VD  (via drill 0.6)  (1 unrouted)
  Top 0.635: R5.1 R6.1 51,19.1 | J10.2 51.83,19.93 | R4.1 54.7,30.6 Q1.3 51.83,19.93 | 51,19.1 51.83,19.93 | TP4.TP 51,19.1
  other vias: 61.26,37.95 61.26,40.95 61.26,16.95 61.26,12.95
  pour Top (no thermals): 60.26,41.95 62.26,41.95 62.26,11.35 60.26,11.35
  pour Bottom (no thermals): 60.26,41.95 62.26,41.95 62.26,11.35 60.26,11.35
ZEROOHM
  Top 0.635: Q1.2 R7.2

### Text on the board
tPlace: Lincoln Glauser / P17105: HABIP / SPRING 2K17 / 002-003-01 | Buzzer
tNames: LDO | 555